# Altium schematic sheet NullerCarrier.SchDoc
size Letter; Author: Adam Gilbert; CompanyName: McGill University; DrawnBy: Adam Gilbert; Organization: Altium Limited; Address1: McGill Cosmology; Address2: 3600 University Street; Address3: Montreal, Quebec; Address4: Canada; DocumentNumber: 6; Revision: Rev2; SheetNumber: 6; SheetTotal: 16; ProjectTitle: DfMux FMC Mezz; ModelNumber: MGMEZZ04; ProjectName: DfMux FMC Mezz
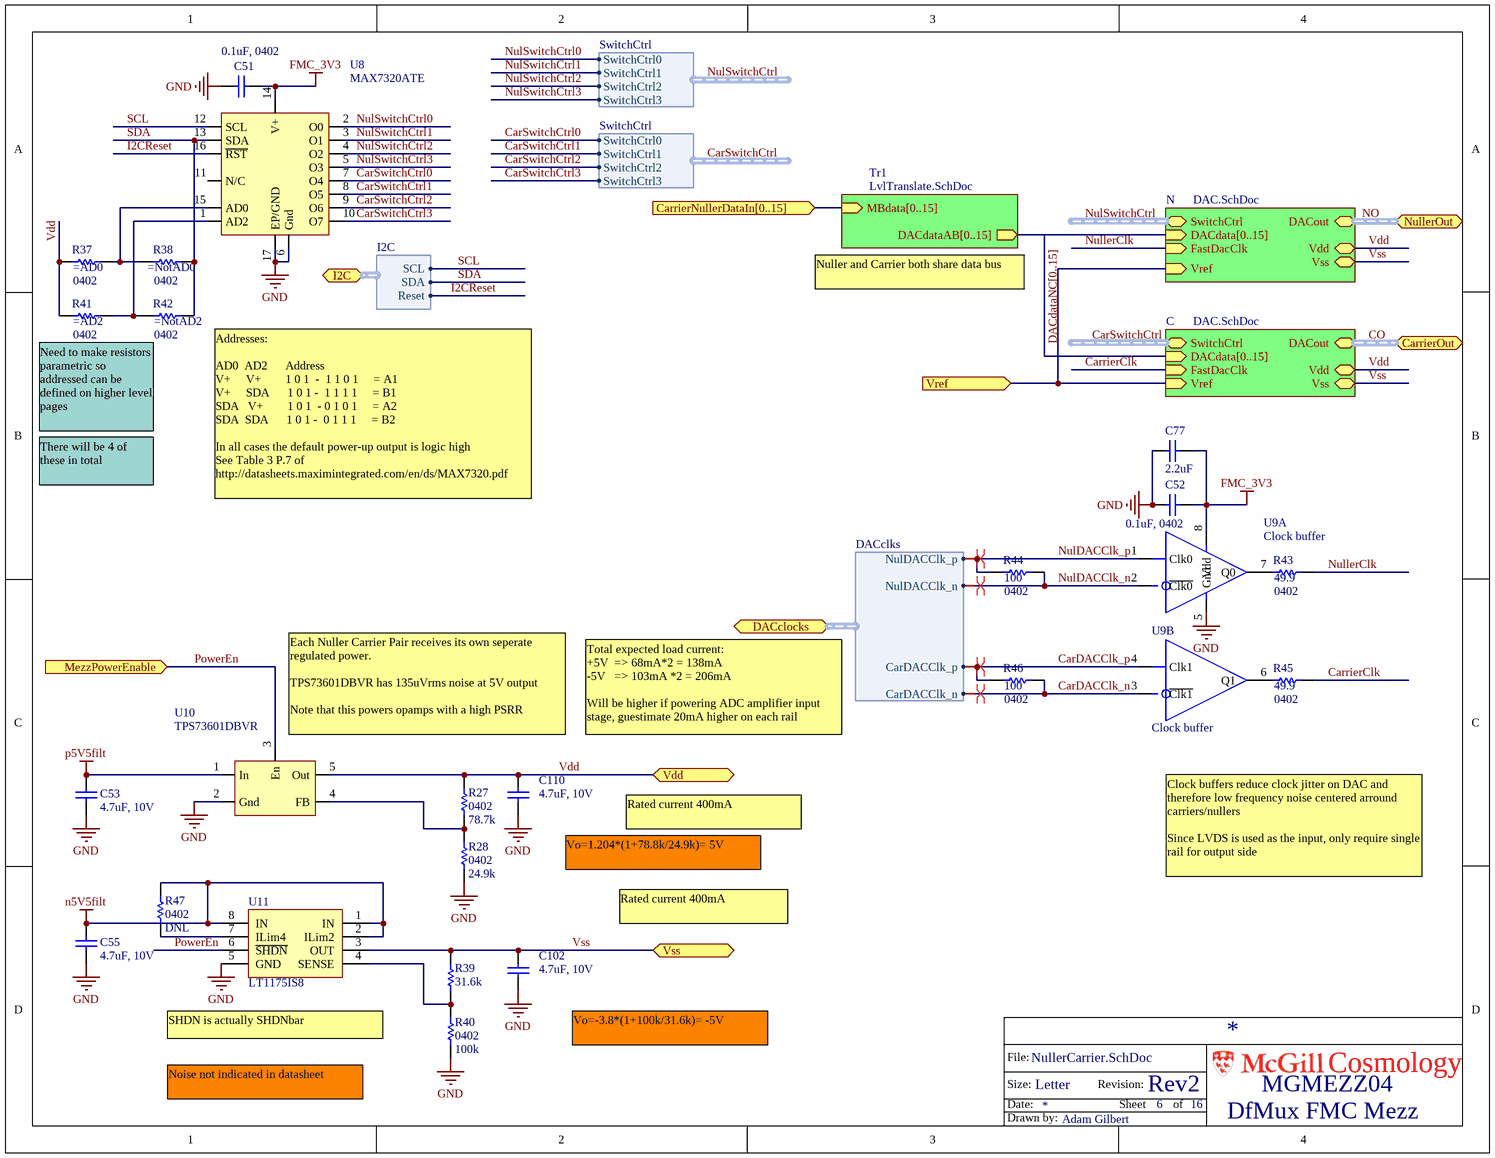
[diagram p0: NullerCarrier.SchDoc]

## Parts
C51  0.1uF, 0402  [0402]
C52  0.1uF, 0402  [0402]
C53  4.7uF, 10V  [0805]
C55  4.7uF, 10V  [0805]
C77  2.2uF  [0603]
C102  4.7uF, 10V  [0805]
C110  4.7uF, 10V  [0805]
R27  78.7k  [0402]
R28  24.9k  [0402]
R37  (no value)  [0402]
R38  (no value)  [0402]
R39  31.6k  [0603]
R40  100k  [0402]
R41  (no value)  [0402]
R42  (no value)  [0402]
R43  49.9  [0402]
R44  100  [0402]
R45  49.9  [0402]
R46  100  [0402]
R47  DNL  [0402]
U8  MAX7320ATE  [QFN127P600-8N-MAX7319]
U9  Clock buffer  [SO8]  (parts A,B of 2)
U10  TPS73601DBVR  [SOT23-5]
U11  LT1175IS8  [SO8]

## Sub-sheets
C = DAC.SchDoc: DACout (harness DACout), SwitchCtrl (harness SwitchCtrl), DACdata[0..15] (in), FastDacClk (in), Vdd, Vss, Vref (in)
N = DAC.SchDoc: DACout (harness DACout), SwitchCtrl (harness SwitchCtrl), DACdata[0..15] (in), FastDacClk (in), Vdd, Vss, Vref (in)
Tr1 = LvlTranslate.SchDoc: DACdataAB[0..15] (out), MBdata[0..15] (in)

## Ports
CarrierNullerDataIn[0..15] (in), CarrierOut (harness DACout), DACclocks (harness DACclks), I2C (harness I2C), MezzPowerEnable (in), NullerOut (harness DACout), Vdd, Vref (in), Vss

## Harnesses
SwitchCtrl: SwitchCtrl0, SwitchCtrl1, SwitchCtrl2, SwitchCtrl3
DACclks: NulDACClk_p, NulDACClk_n, CarDACClk_p, CarDACClk_n
I2C: SCL, SDA, Reset

## Nets
FMC_3V3: C51.2 C52.1 C77.2 U8.14(V+) U9.8(Vdd)
GND: C51.1 C52.2 C53.1 C55.1 C77.1 C102.1 C110.1 R28.1 R40.1 U8.6(Gnd) U8.17(EP/GND) U9.5(Gnd) U10.2(Gnd) U11.5(GND)
n5V5filt: C55.2 R47.2 U11.1(IN) U11.2(ILim2) U11.8(IN)
p5V5filt: C53.2 U10.1(In)
CarDACClk_n: R46.2 U9.3(~{Clk1}) ; port DACclocks.CarDACClk_n
CarDACClk_p: R46.1 U9.4(Clk1) ; port DACclocks.CarDACClk_p
CarrierClk: R45.2 ; sheet C/FastDacClk
CarSwitchCtrl0: U8.7(O4) ; sheet C/SwitchCtrl.SwitchCtrl0  [project net CarSwitchCtrl.SwitchCtrl0]
CarSwitchCtrl1: U8.8(O5) ; sheet C/SwitchCtrl.SwitchCtrl1  [project net CarSwitchCtrl.SwitchCtrl1]
CarSwitchCtrl2: U8.9(O6) ; sheet C/SwitchCtrl.SwitchCtrl2  [project net CarSwitchCtrl.SwitchCtrl2]
CarSwitchCtrl3: U8.10(O7) ; sheet C/SwitchCtrl.SwitchCtrl3  [project net CarSwitchCtrl.SwitchCtrl3]
I2CReset: U8.16(~{RST}) ; port I2C.Reset
NulDACClk_n: R44.2 U9.2(~{Clk0}) ; port DACclocks.NulDACClk_n
NulDACClk_p: R44.1 U9.1(Clk0) ; port DACclocks.NulDACClk_p
NullerClk: R43.2 ; sheet N/FastDacClk
NulSwitchCtrl0: U8.2(O0) ; sheet N/SwitchCtrl.SwitchCtrl0  [project net NulSwitchCtrl.SwitchCtrl0]
NulSwitchCtrl1: U8.3(O1) ; sheet N/SwitchCtrl.SwitchCtrl1  [project net NulSwitchCtrl.SwitchCtrl1]
NulSwitchCtrl2: U8.4(O2) ; sheet N/SwitchCtrl.SwitchCtrl2  [project net NulSwitchCtrl.SwitchCtrl2]
NulSwitchCtrl3: U8.5(O3) ; sheet N/SwitchCtrl.SwitchCtrl3  [project net NulSwitchCtrl.SwitchCtrl3]
PowerEn: U10.3(En) U11.6(~{SHDN}) ; port MezzPowerEnable
SCL: U8.12(SCL) ; port I2C.SCL
SDA: R38.2 R42.2 U8.13(SDA) ; port I2C.SDA
Vdd: C110.2 R27.2 R37.1 R41.1 U10.5(Out) ; port Vdd, sheet N/Vdd, sheet C/Vdd
Vref: port Vref, sheet N/Vref, sheet C/Vref
Vss: C102.2 R39.1 U11.3(OUT) ; port Vss, sheet N/Vss, sheet C/Vss
NetR27_1: R27.1 R28.2 U10.4(FB)
NetR37_2: R37.2 R38.1 U8.15(AD0)
NetR39_2: R39.2 R40.2 U11.4(SENSE)
NetR41_2: R41.2 R42.1 U8.1(AD2)
NetR43_1: R43.1 U9.7(Q0)
NetR45_1: R45.1 U9.6(Q1)
NetR47_1: R47.1 U11.7(ILim4)

Not connected (* = marked no-connect by the designer): U8 11(N/C)

## Buses and harness runs
bus DACdataNC[0..15] = sheet C/DACdata[0..15] = sheet N/DACdata[0..15] = sheet Tr1/DACdataAB[0..15]
bus port CarrierNullerDataIn[0..15] = sheet Tr1/MBdata[0..15]
harness CarSwitchCtrl = sheet C/SwitchCtrl
harness CO = port CarrierOut = sheet C/DACout
harness NO = port NullerOut = sheet N/DACout
harness NulSwitchCtrl = sheet N/SwitchCtrl

## Layout directives
differential pair: CarDACClk_n, CarDACClk_p, NulDACClk_n, NulDACClk_p

## Notes on the sheet
- Nuller and Carrier both share data bus
- Need to make resistors parametric so addressed can be defined on higher level pages
- There will be 4 of these in total
- (near R42) Addresses:
  AD0  AD2      Address
  V+     V+        1 0 1  -  1 1 0 1     = A1
  V+     SDA      1 0 1 -  1 1 1 1     = B1
  SDA   V+        1 0 1  - 0 1 0 1     = A2
  SDA  SDA      1 0 1 -  0 1 1 1     = B2
  In all cases the default power-up output is logic high
  See Table 3 P.7 of http://datasheets.maximintegrated.com/en/ds/MAX7320.pdf
- (near U10) Each Nuller Carrier Pair receives its own seperate regulated power.
  TPS73601DBVR has 135uVrms noise at 5V output
  Note that this powers opamps with a high PSRR
- Total expected load current:
  +5V  => 68mA*2 = 138mA
  -5V   => 103mA *2 = 206mA
  Will be higher if powering ADC amplifier input stage, guestimate 20mA higher on each rail
- Rated current 400mA
- Vo=1.204*(1+78.8k/24.9k)= 5V
- Clock buffers reduce clock jitter on DAC and therefore low frequency noise centered arround carriers/nullers
  Since LVDS is used as the input, only require single rail for output side
- SHDN is actually SHDNbar
- Vo=-3.8*(1+100k/31.6k)= -5V
- Noise not indicated in datasheet
- File:
- Size:
- Date:
- Letter
- Revision:
- Sheet
- of
- Cosmology
- Drawn by:

## Library data of the parts
C51 C52 = CAP 0603: Capacitor, Ceramic, 0402; Part Constraints: 10% 10V X5R 0402; Manufacturer: TDK Corporation; Manufacturer Part Number 1: C1005X5R1A104K050BA; Temperature Coefficient: X5R; Assembly Comments: none; Value: 0.1uF, 0402; Supplier 1: Digi-Key; Supplier Part Number 1: 445-1265-1-ND; Operating Temperature: -55°C ~ 85°C; Thickness (Max): 0.022" (0.55mm); Packaging: Cut Tape (CT)
C53 C55 C102 C110 = CAP 0805: Capacitor, Ceramic, 0805; Manufacturer Part Number 1: LMK212BJ475KD-T; Manufacturer: Taiyo Yuden; Temperature Coefficient: X5R; Assembly Comments: none; Supplier 1: Digi-Key; Supplier Part Number 1: 587-1297-6-ND; Packaging: Digi-Reel®; Operating Temperature: -55°C ~ 85°C; Thickness (Max): 0.037" (0.95mm); Value: 4.7uF, 10V; Part Constraints: LMK212BJ475KD-T
C77 = CAP 0603: Capacitor, Ceramic, 0603; Part Constraints: 10% 6.3V X5R 0603; Manufacturer: TDK Corporation; Manufacturer Part Number 1: C1608X5R0J225K080AB; Assembly Comments: none; Temperature Coefficient: X5R; Value: 2.2uF; Supplier 1: Digi-Key; Supplier Part Number 1: 445-5175-1-ND; Operating Temperature: -55°C ~ 85°C; Thickness (Max): 0.037" (0.95mm); Packaging: Cut Tape (CT)
R27 R28 R37 R38 R40-R47 = RES 0402: Resistor; Manufacturer: Generic; Part Constraints: 1% 1/10W 100ppm 0402; Assembly Comments: none; Manufacturer Part Number 1: Generic
  R27: Value: 78.7k
  R28: Value: 24.9k
  R37: Value: =AD0
  R38: Value: =NotAD0
  R40: Value: 100k
  R41: Value: =AD2
  R42: Value: =NotAD2
  R43 R45: Value: 49.9
  R44 R46: Value: 100
  R47: Value: DNL
R39 = RES 0603: Resistor; Manufacturer: Generic; Part Constraints: 1% 1/10W 100ppm 0603; Assembly Comments: none; Value: 31.6k; Manufacturer Part Number 1: Generic
U8 = MAX7320ATE: IO expander 8bit I2C; Manufacturer Part Number 1: MAX7320ATE+; Manufacturer: Maxim Integrated; Assembly Comments: none; Supplier 1: Digi-Key; Packaging: Tube; Operating Temperature: -40°C ~ 125°C; Supplier Part Number 1: MAX7320ATE+-ND; Part Constraints: MAX7320ATE+
U9 = ICS83023AMILF: IC CLK TRANSLTR 1:1 350MHZ 8SOIC; Manufacturer: IDT, Integrated Device Technology Inc; Assembly Comments: none; Supplier 1: Digi-Key; Manufacturer Part Number 1: ICS83023AMILF; Operating Temperature: -40°C ~ 85°C; Packaging: Tube; Supplier Part Number 1: 800-1102-5-ND; Part Constraints: ICS83023AMILF
U10 = TPS73601DBVR: Adjustable 30uVrms noise 400mA regulator; Manufacturer Part Number 1: TPS73601DBVT; Manufacturer: Texas Instruments; Assembly Comments: none; Supplier 1: Digi-Key; Operating Temperature: -40°C ~ 125°C; Packaging: Cut Tape (CT); Supplier Part Number 1: 296-15814-1-ND; Part Constraints: TPS73601DBVT
U11 = LT1175IS8: REG, negative micropower low dropout; Manufacturer: Linear Technology; Manufacturer Part Number 1: LT1175IS8#PBF; Assembly Comments: none; Part Constraints: LT1175IS8; Supplier 1: Digi-Key; Supplier Part Number 1: LT1175IS8#PBF-ND